# Altium schematic sheet 04_ethernet.SchDoc
size D; CompanyName: Signal Laboratories, Inc.; Address1: 3479 Edison Way; Address2: Menlo Park CA 94025; Address3: +1 (877) 778-8435; Address4: siglabs.com; Revision: 1; SheetNumber: 1; SheetTotal: 1
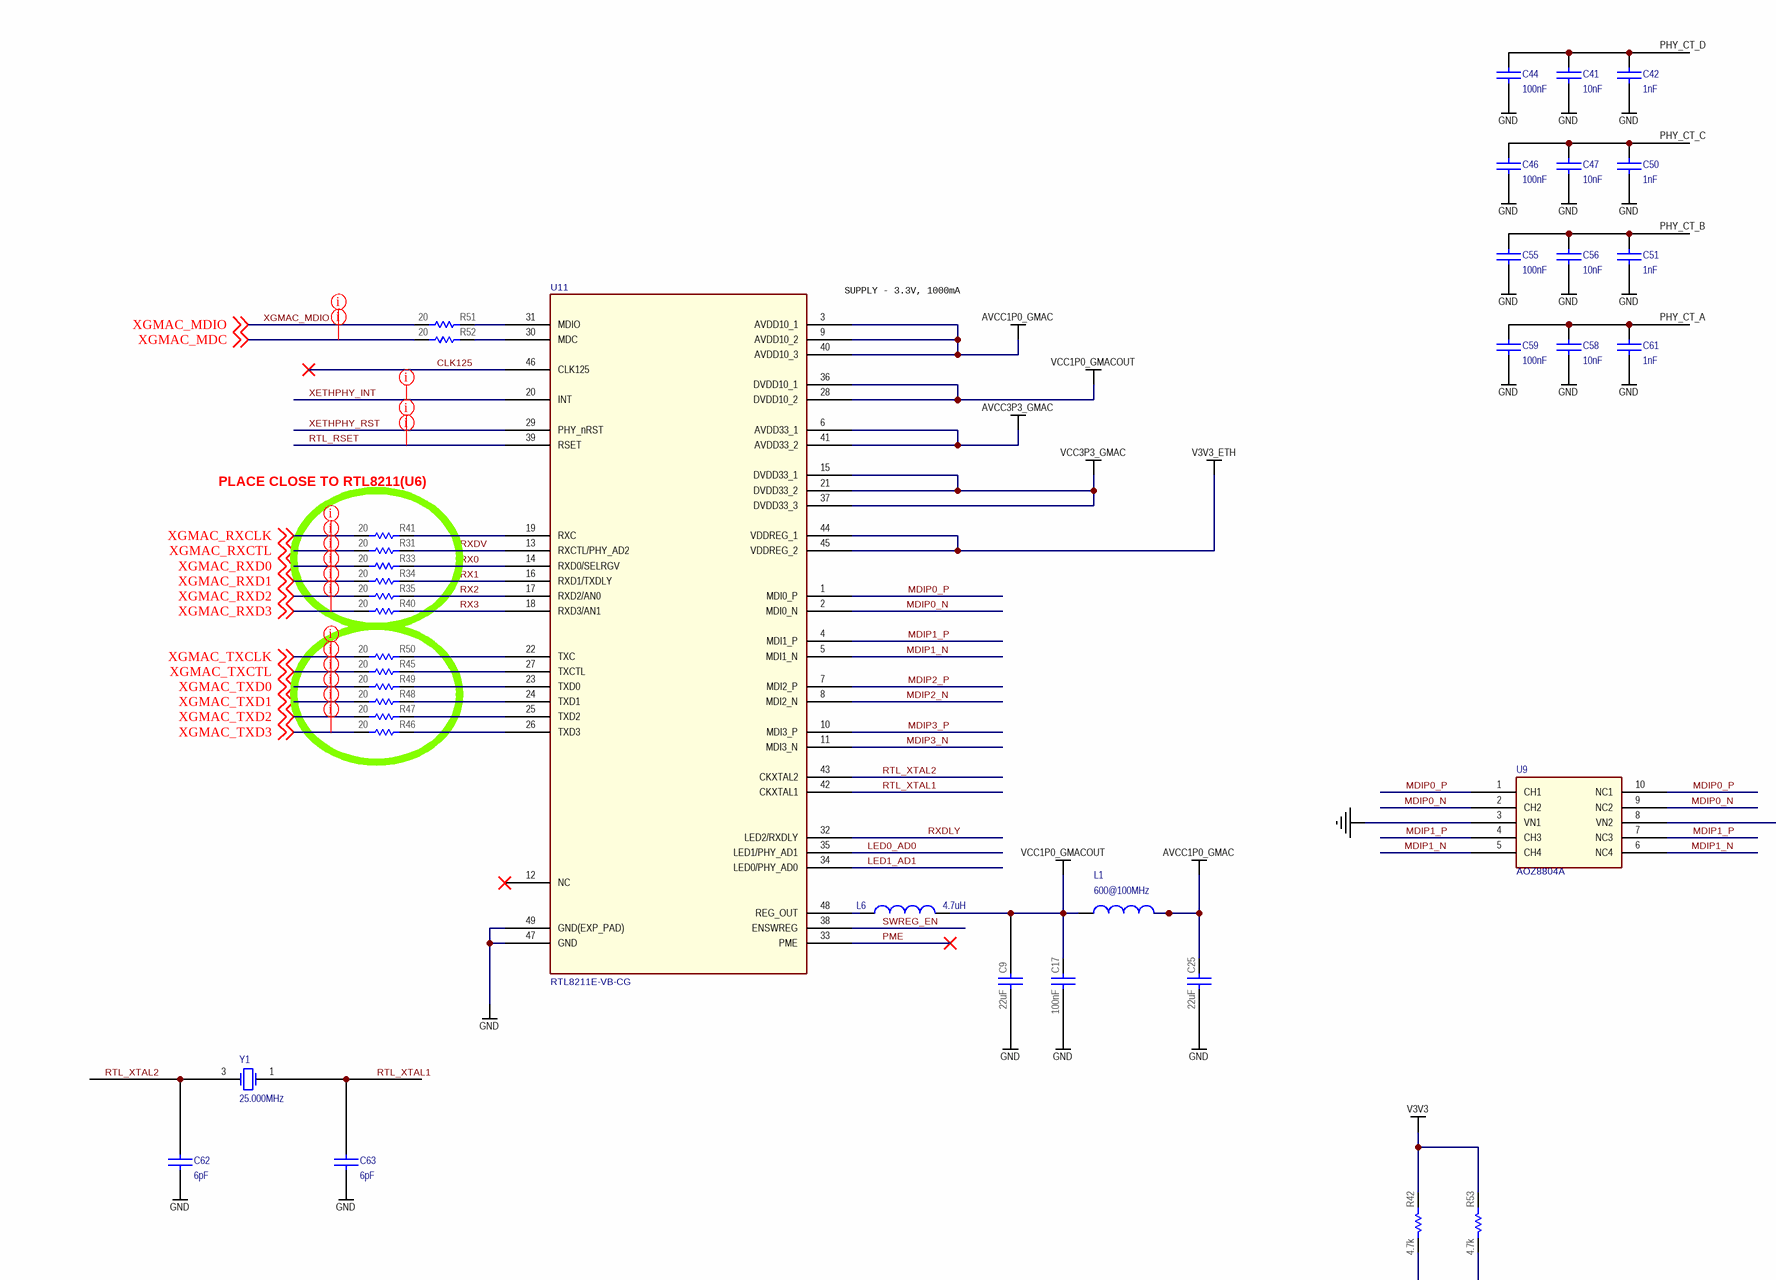
[diagram p0: 04_ethernet.SchDoc, top left]
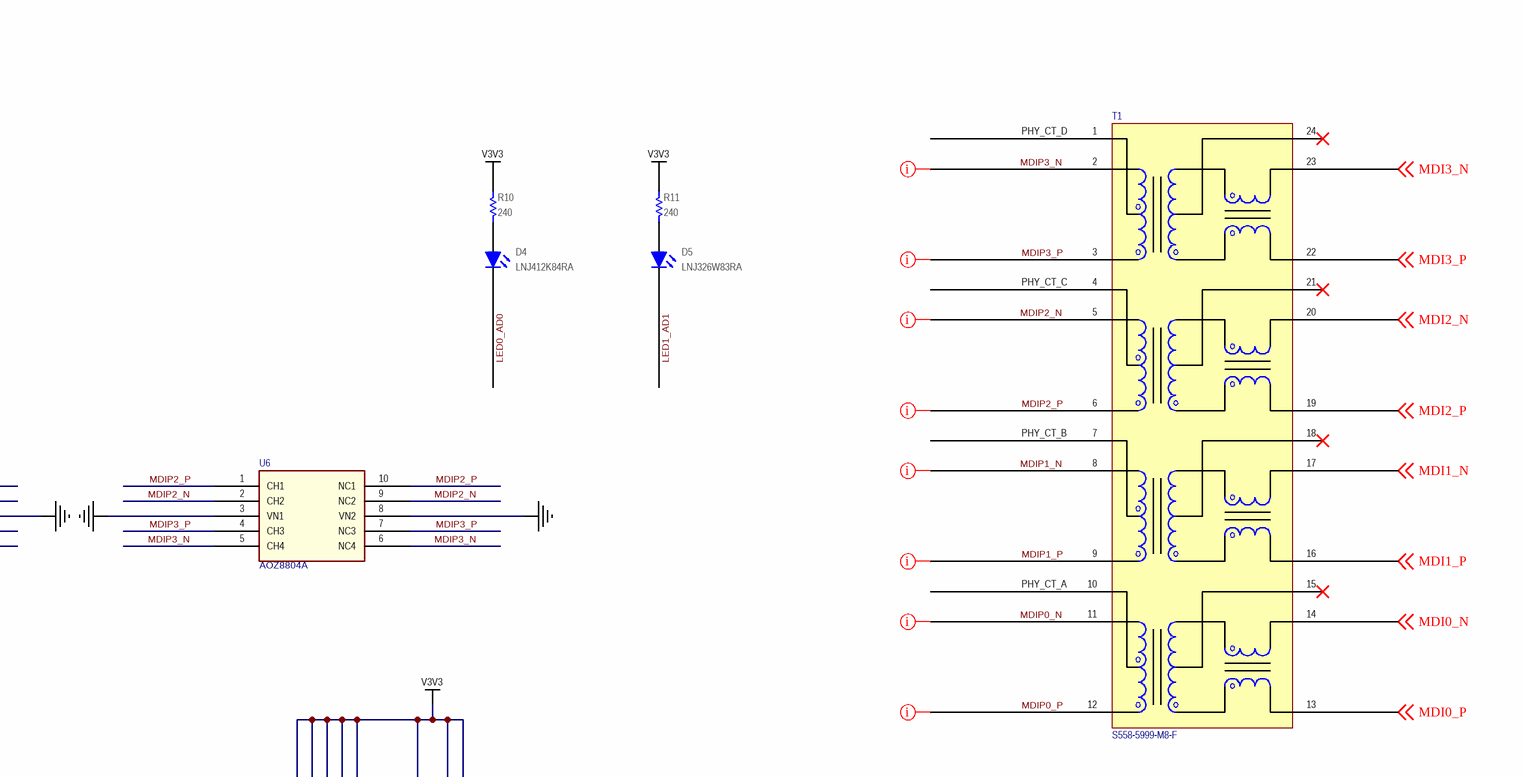
[diagram p1: 04_ethernet.SchDoc, top right]
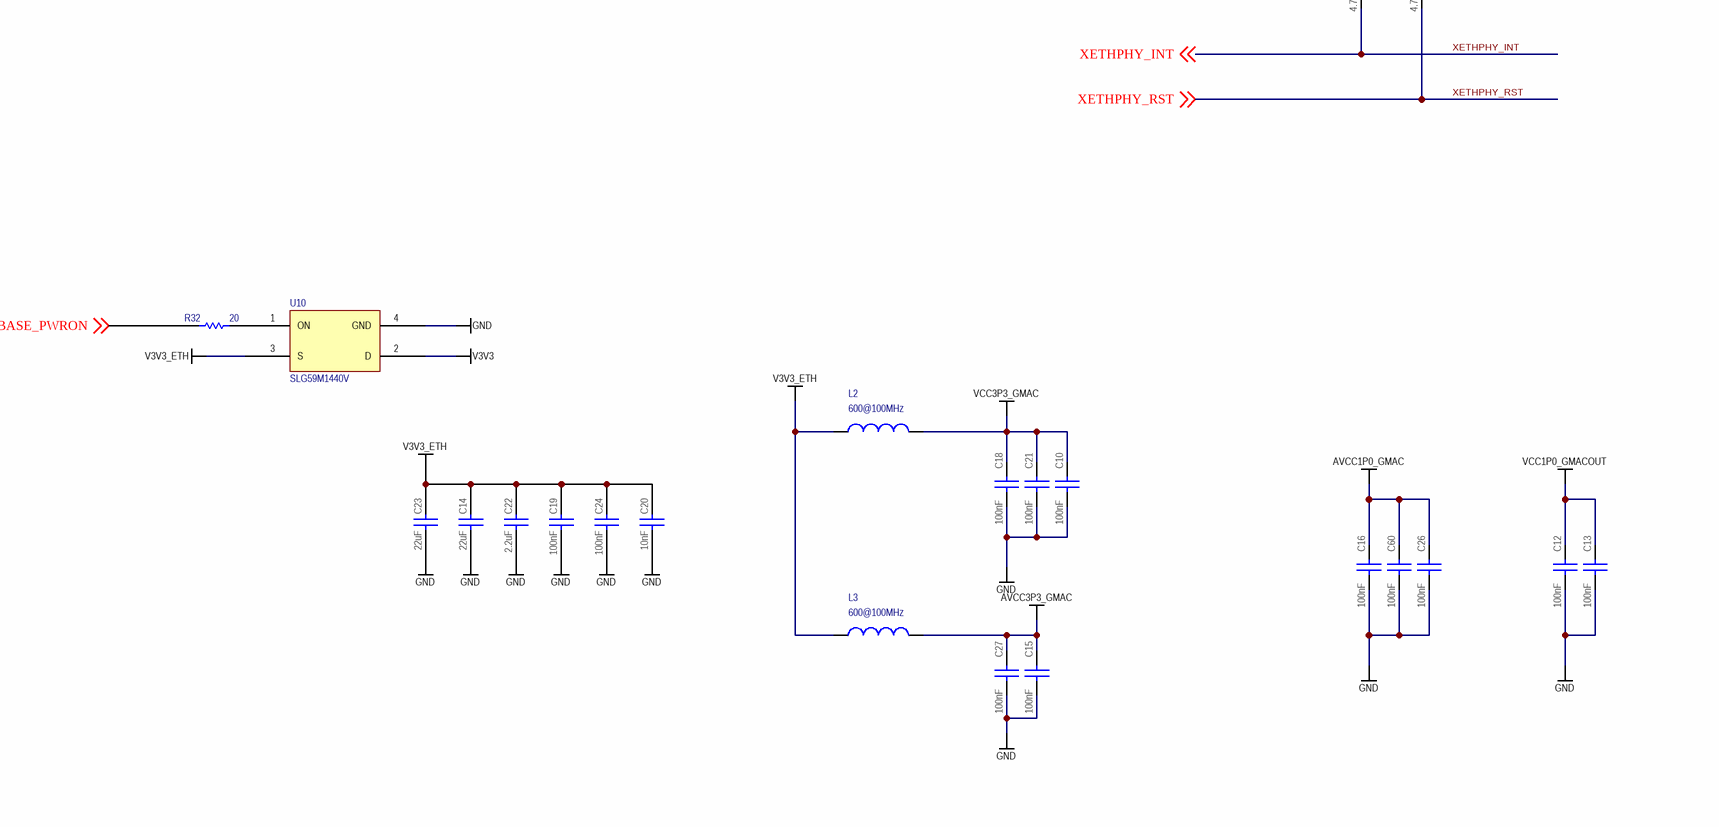
[diagram p2: 04_ethernet.SchDoc, bottom left]
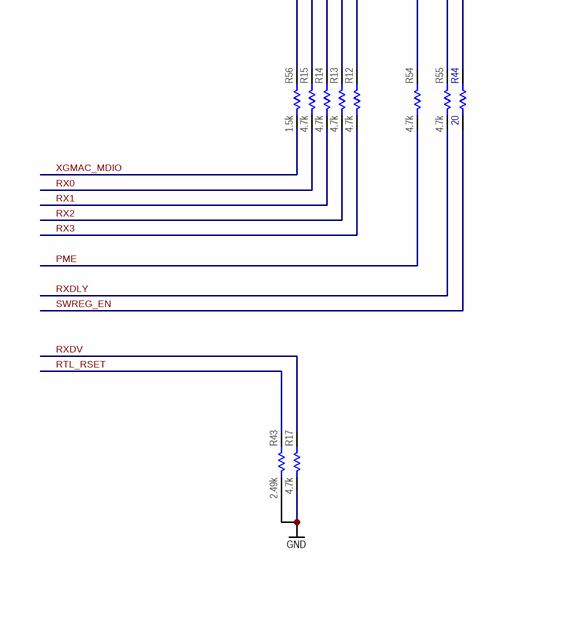
[diagram p3: 04_ethernet.SchDoc, bottom right]

## Parts
C9  value 22uF  [CAPC200X125X145L45N]  (hidden comment: C2012X7S1A226M125)
C10  value 100nF  [CAPC100X50X55L25N]  (hidden comment: GCM155R71H104KE02)
C12  value 100nF  [CAPC100X50X55L25N]  (hidden comment: GCM155R71H104KE02)
C13  value 100nF  [CAPC100X50X55L25N]  (hidden comment: GCM155R71H104KE02)
C14  value 22uF  [CAPC200X125X145L45N]  (hidden comment: C2012X7S1A226M125)
C15  value 100nF  [CAPC100X50X55L25N]  (hidden comment: GCM155R71H104KE02)
C16  value 100nF  [CAPC100X50X55L25N]  (hidden comment: GCM155R71H104KE02)
C17  value 100nF  [CAPC100X50X55L25N]  (hidden comment: GCM155R71H104KE02)
C18  value 100nF  [CAPC100X50X55L25N]  (hidden comment: GCM155R71H104KE02)
C19  value 100nF  [CAPC100X50X55L25N]  (hidden comment: GCM155R71H104KE02)
C20  value 10nF  [CAPC100X50X55L25N]  (hidden comment: GRM155R71H103KA88)
C21  value 100nF  [CAPC100X50X55L25N]  (hidden comment: GCM155R71H104KE02)
C22  value 2.2uF  [CAPC160X80X90L20N]  (hidden comment: C1608X7R1A225M080)
C23  value 22uF  [CAPC200X125X145L45N]  (hidden comment: C2012X7S1A226M125)
C24  value 100nF  [CAPC100X50X55L25N]  (hidden comment: GCM155R71H104KE02)
C25  value 22uF  [CAPC200X125X145L45N]  (hidden comment: C2012X7S1A226M125)
C26  value 100nF  [CAPC100X50X55L25N]  (hidden comment: GCM155R71H104KE02)
C27  value 100nF  [CAPC100X50X55L25N]  (hidden comment: GCM155R71H104KE02)
C41  value 10nF  [0402]  (hidden comment: GRM155R71E103KA01D)
C42  value 1nF  [0402]  (hidden comment: GRM1555C1H102JA01D)
C44  value 100nF  [0402]  (hidden comment: GRM155R71C104KA88J)
C46  value 100nF  [0402]  (hidden comment: GRM155R71C104KA88J)
C47  value 10nF  [0402]  (hidden comment: GRM155R71E103KA01D)
C50  value 1nF  [0402]  (hidden comment: GRM1555C1H102JA01D)
C51  value 1nF  [0402]  (hidden comment: GRM1555C1H102JA01D)
C55  value 100nF  [0402]  (hidden comment: GRM155R71C104KA88J)
C56  value 10nF  [0402]  (hidden comment: GRM155R71E103KA01D)
C58  value 10nF  [0402]  (hidden comment: GRM155R71E103KA01D)
C59  value 100nF  [0402]  (hidden comment: GRM155R71C104KA88J)
C60  value 100nF  [CAPC100X50X55L25N]  (hidden comment: GCM155R71H104KE02)
C61  value 1nF  [0402]  (hidden comment: GRM1555C1H102JA01D)
C62  value 6pF  [0402]  (hidden comment: GJM1555C1H6R0CB01D)
C63  value 6pF  [0402]  (hidden comment: GJM1555C1H6R0CB01D)
D4  LNJ412K84RA  [0603_LED]
D5  LNJ326W83RA  [0603_LED]
L1  value 600@100MHz  [INDC1005X55N]  (hidden comment: BLM15PX601SN1D)
L2  value 600@100MHz  [INDC1005X55N]  (hidden comment: BLM15PX601SN1D)
L3  value 600@100MHz  [INDC1005X55N]  (hidden comment: BLM15PX601SN1D)
L6  value 4.7uH  [INDC200X125X105L50N]  (hidden comment: CIG21L4R7MNE)
R10  value 240  [RESC1005X40N]  (hidden comment: ERJ-2RKF2400X)
R11  value 240  [RESC1005X40N]  (hidden comment: ERJ-2RKF2400X)
R12  value 4.7k  [RESC1005X40N]  (hidden comment: ERJ-2RKF4701X)
R13  value 4.7k  [RESC1005X40N]  (hidden comment: ERJ-2RKF4701X)
R14  value 4.7k  [RESC1005X40N]  (hidden comment: ERJ-2RKF4701X)
R15  value 4.7k  [RESC1005X40N]  (hidden comment: ERJ-2RKF4701X)
R17  value 4.7k  [RESC1005X40N]  (hidden comment: ERJ-2RKF4701X)
R31  value 20  [RESC1005X40N]  (hidden comment: ERJ-2RKF20R0X)
R32  value 20  [0402]  (hidden comment: ERJ-2RKF20R0X)
R33  value 20  [RESC1005X40N]  (hidden comment: ERJ-2RKF20R0X)
R34  value 20  [RESC1005X40N]  (hidden comment: ERJ-2RKF20R0X)
R35  value 20  [RESC1005X40N]  (hidden comment: ERJ-2RKF20R0X)
R40  value 20  [RESC1005X40N]  (hidden comment: ERJ-2RKF20R0X)
R41  value 20  [RESC1005X40N]  (hidden comment: ERJ-2RKF20R0X)
R42  value 4.7k  [RESC1005X40N]  (hidden comment: ERJ-2RKF4701X)
R43  value 2.49k  [RESC1005X40N]  (hidden comment: ERJ-2RKF2491X)
R44  value 20  [0402]  (hidden comment: ERJ-2RKF20R0X)
R45  value 20  [RESC1005X40N]  (hidden comment: ERJ-2RKF20R0X)
R46  value 20  [RESC1005X40N]  (hidden comment: ERJ-2RKF20R0X)
R47  value 20  [RESC1005X40N]  (hidden comment: ERJ-2RKF20R0X)
R48  value 20  [RESC1005X40N]  (hidden comment: ERJ-2RKF20R0X)
R49  value 20  [RESC1005X40N]  (hidden comment: ERJ-2RKF20R0X)
R50  value 20  [RESC1005X40N]  (hidden comment: ERJ-2RKF20R0X)
R51  value 20  [RESC1005X40N]  (hidden comment: ERJ-2RKF20R0X)
R52  value 20  [RESC1005X40N]  (hidden comment: ERJ-2RKF20R0X)
R53  value 4.7k  [RESC1005X40N]  (hidden comment: ERJ-2RKF4701X)
R54  value 4.7k  [RESC1005X40N]  (hidden comment: ERJ-2RKF4701X)
R55  value 4.7k  [RESC1005X40N]  (hidden comment: ERJ-2RKF4701X)
R56  value 1.5k  [RESC1005X40N]  (hidden comment: ERJ-2RKF1501X)
T1  S558-5999-M8-F  [SOIC127P1524X571-24N]
U6  AOZ8804A  [AOZ8804]
U9  AOZ8804A  [AOZ8804]
U10  SLG59M1440V  [SLG59M1440V]
U11  RTL8211E-VB-CG  [QFN48]
Y1  Freq: 25.000MHz  [XRCGB]  (hidden comment: XRCGB25M000F3N00R0)

## Nets
AVCC1P0_GMAC: C16.2 C25.2 C26.2 C60.2 L1.2 U11.3(AVDD10_1) U11.9(AVDD10_2) U11.40(AVDD10_3)
AVCC3P3_GMAC: C15.2 C27.2 L3.2 U11.6(AVDD33_1) U11.41(AVDD33_2)
GND: C9.1 C10.1 C12.1 C13.1 C14.1 C15.1 C16.1 C17.1 C18.1 C19.1 C20.2 C21.1 C22.1 C23.1 C24.1 C25.1 C26.1 C27.1 C41.1 C42.1 C44.1 C46.1 C47.1 C50.1 C51.1 C55.1 C56.1 C58.1 C59.1 C60.1 C61.1 C62.1 C63.1 R17.1 R43.2 U6.3(VN1) U6.8(VN2) U9.3(VN1) U9.8(VN2) U10.4(GND) U11.47(GND) U11.49(GND(EXP_PAD))
V3V3: R10.1 R11.1 R12.2 R13.2 R14.2 R15.2 R42.2 R44.1 R53.2 R54.2 R55.2 R56.1 U10.2(D)
V3V3_ETH: C14.2 C19.2 C20.1 C22.2 C23.2 C24.2 L2.1 L3.1 U10.3(S) U11.44(VDDREG_1) U11.45(VDDREG_2)
VCC1P0_GMACOUT: C9.2 C12.2 C13.2 C17.2 L1.1 L6.2 U11.28(DVDD10_2) U11.36(DVDD10_1)
VCC3P3_GMAC: C10.2 C18.2 C21.2 L2.2 U11.15(DVDD33_1) U11.21(DVDD33_2) U11.37(DVDD33_3)
CLK125: U11.46(CLK125)
LED0_AD0: D4.2(K) U11.35(LED1/PHY_AD1)
LED1_AD1: D5.2(K) U11.34(LED0/PHY_AD0)
MDI0_N: T1.14(TXONA) ; off-sheet MDI0_N
MDI0_P: T1.13(TXOPA) ; off-sheet MDI0_P
MDI1_N: T1.17(TXONB) ; off-sheet MDI1_N
MDI1_P: T1.16(TXOPB) ; off-sheet MDI1_P
MDI2_N: T1.20(TXONC) ; off-sheet MDI2_N
MDI2_P: T1.19(TXOPC) ; off-sheet MDI2_P
MDI3_N: T1.23(TXOND) ; off-sheet MDI3_N
MDI3_P: T1.22(TXOPD) ; off-sheet MDI3_P
MDIP0_N: T1.11(TPONA) U9.2(CH2) U9.9(NC2) U11.2(MDI0_N)
MDIP0_P: T1.12(TPOPA) U9.1(CH1) U9.10(NC1) U11.1(MDI0_P)
MDIP1_N: T1.8(TPONB) U9.5(CH4) U9.6(NC4) U11.5(MDI1_N)
MDIP1_P: T1.9(TPOPB) U9.4(CH3) U9.7(NC3) U11.4(MDI1_P)
MDIP2_N: T1.5(TPONC) U6.2(CH2) U6.9(NC2) U11.8(MDI2_N)
MDIP2_P: T1.6(TPOPC) U6.1(CH1) U6.10(NC1) U11.7(MDI2_P)
MDIP3_N: T1.2(TPOND) U6.5(CH4) U6.6(NC4) U11.11(MDI3_N)
MDIP3_P: T1.3(TPOPD) U6.4(CH3) U6.7(NC3) U11.10(MDI3_P)
PHY_CT_A: C58.2 C59.2 C61.2 T1.10(TCTA)
PHY_CT_B: C51.2 C55.2 C56.2 T1.7(TCTB)
PHY_CT_C: C46.2 C47.2 C50.2 T1.4(TCTC)
PHY_CT_D: C41.2 C42.2 C44.2 T1.1(TCTD)
PME: R54.1 U11.33(PME)
RTL_RSET: R43.1 U11.39(RSET)
RTL_XTAL1: C63.2 U11.42(CKXTAL1) Y1.1(OSC1)
RTL_XTAL2: C62.2 U11.43(CKXTAL2) Y1.3(OSC2)
RX0: R15.1 R33.2 U11.14(RXD0/SELRGV)
RX1: R14.1 R34.2 U11.16(RXD1/TXDLY)
RX2: R13.1 R35.2 U11.17(RXD2/AN0)
RX3: R12.1 R40.2 U11.18(RXD3/AN1)
RXDLY: R55.1 U11.32(LED2/RXDLY)
RXDV: R17.2 R31.2 U11.13(RXCTL/PHY_AD2)
SWREG_EN: R44.2 U11.38(ENSWREG)
XBASE_PWRON: R32.2 ; off-sheet XBASE_PWRON
XETHPHY_INT: R42.1 U11.20(INT) ; off-sheet XETHPHY_INT
XETHPHY_RST: R53.1 U11.29(PHY_nRST) ; off-sheet XETHPHY_RST
XGMAC_MDC: R52.1 ; off-sheet XGMAC_MDC
XGMAC_MDIO: R51.1 R56.2 ; off-sheet XGMAC_MDIO
XGMAC_RXCLK: R41.1 ; off-sheet XGMAC_RXCLK
XGMAC_RXCTL: R31.1 ; off-sheet XGMAC_RXCTL
XGMAC_RXD0: R33.1 ; off-sheet XGMAC_RXD0
XGMAC_RXD1: R34.1 ; off-sheet XGMAC_RXD1
XGMAC_RXD2: R35.1 ; off-sheet XGMAC_RXD2
XGMAC_RXD3: R40.1 ; off-sheet XGMAC_RXD3
XGMAC_TXCLK: R50.1 ; off-sheet XGMAC_TXCLK
XGMAC_TXCTL: R45.1 ; off-sheet XGMAC_TXCTL
XGMAC_TXD0: R49.1 ; off-sheet XGMAC_TXD0
XGMAC_TXD1: R48.1 ; off-sheet XGMAC_TXD1
XGMAC_TXD2: R47.1 ; off-sheet XGMAC_TXD2
XGMAC_TXD3: R46.1 ; off-sheet XGMAC_TXD3
NetD4_1: D4.1(A) R10.2
NetD5_1: D5.1(A) R11.2
NetL6_1: L6.1 U11.48(REG_OUT)
NetR32_1: R32.1 U10.1(ON)
NetR41_2: R41.2 U11.19(RXC)
NetR45_2: R45.2 U11.27(TXCTL)
NetR46_2: R46.2 U11.26(TXD3)
NetR47_2: R47.2 U11.25(TXD2)
NetR48_2: R48.2 U11.24(TXD1)
NetR49_2: R49.2 U11.23(TXD0)
NetR50_2: R50.2 U11.22(TXC)
NetR51_2: R51.2 U11.31(MDIO)
NetR52_2: R52.2 U11.30(MDC)

Not connected (* = marked no-connect by the designer): T1 15(TXTA)* 18(TXTB)* 21(TXTC)* 24(TXTD)*; U11 12(NC)*; Y1 2(NC) 4(NC)

## Layout directives
net class ETH: MDIP0_N, MDIP0_P, MDIP1_N, MDIP1_P, MDIP2_N, MDIP2_P, MDIP3_N, MDIP3_P
net class MAC: RTL_RSET, XETHPHY_INT, XETHPHY_RST, XGMAC_MDC, XGMAC_MDIO, XGMAC_RXCLK, XGMAC_RXCTL, XGMAC_RXD0, XGMAC_RXD1, XGMAC_RXD2, XGMAC_RXD3, XGMAC_TXCLK, XGMAC_TXCTL, XGMAC_TXD0, XGMAC_TXD1, XGMAC_TXD2, XGMAC_TXD3

## Notes on the sheet
- (near U11) SUPPLY - 3.3V, 1000mA
- PLACE CLOSE TO RTL8211(U6)
- Title
- Engineer
- Revision
- Drawn By
- Sheet
- of
- Checked By
- Date

## Library data of the parts
C9 C14 C23 C25 = CAP: Ceramic Capacitor 22uF ±20% 10V X7S 0805; Manufacturer: TDK; Tr: -55:125; Manufacturer P/N: C2012X7S1A226M125; Tolerance: ±20%; Voltage: 10V; Package: 0805
C10 C12 C13 C15-C19 C21 C24 C26 C27 C60 = CAP: Ceramic Capacitor 100nF ±10% 50V X7R 0402; Manufacturer: Murata; Tr: -55:125; Manufacturer P/N: GCM155R71H104KE02; Tolerance: ±10%; Voltage: 50V; Footprint: *; Package: 0402
C20 = CAP: Ceramic Capacitor 10nF ±10% 50V X7R 0402; Manufacturer: Murata; Tr: -55:125; Manufacturer P/N: GRM155R71H103KA88; Tolerance: ±10%; Voltage: 50V; Package: 0402
C22 = CAP: Ceramic Capacitor 2.2uF ±20% 10V X7R 0603; Manufacturer: TDK; Tr: -55:125; Manufacturer P/N: C1608X7R1A225M080; Tolerance: ±20%; Voltage: 10V; Footprint: *; Package: 0603
C41 C47 C56 C58 = CAP 0402: Ceramic Capacitor 10nF ±10% 25V X7R 0402; Manufacturer: Murata; Tr: -55:125; Voltage: 25V; Manufacturer P/N: GRM155R71E103KA01D; Package: 0402; Tolerance: ±10%
C42 C50 C51 C61 = CAP 0402: Ceramic Capacitor 1nF ±5% 50V NP0 0402; Manufacturer: Murata; Tr: -55:125; Voltage: 50V; Manufacturer P/N: GRM1555C1H102JA01D; Package: 0402; Tolerance: ±5%
C44 C46 C55 C59 = CAP 0402: Ceramic Capacitor 100nF ±10% 16V X7R 0402; Manufacturer: Murata; Tr: -55:125; Voltage: 16V; Manufacturer P/N: GRM155R71C104KA88J; Package: 0402; Tolerance: ±10%
C62 C63 = CAP 0402: Ceramic Capacitor 6pF ±0.25pF 50V NP0 RF 0402; Manufacturer: Murata; Tr: -55:125; Voltage: 50V; Manufacturer P/N: GJM1555C1H6R0CB01D; Package: 0402; Tolerance: ±0.25pF
D4 = LED0603Y: LED, SMT 0603, Color Amber, 10mA, 2.05V; Manufacturer: Panasonic; Manufacturer P/N: LNJ412K84RA; Package: 0603 Polarized
D5 = LED0603GR: LED, SMT 0603, Color Green, 10mA, 2.05V; Manufacturer: Panasonic; Manufacturer P/N: LNJ326W83RA; Package: 0603 Polarized
L1-L3 = IND 0402: Ferrite Bead 600-Ohm @ 100MHz 900mA 0402; Manufacturer: Murata; Tolerance: ±25%; Tr: -55:125; Manufacturer P/N: BLM15PX601SN1D; Package: 0402
L6 = INDUCTOR: 4.7uH Inductor 750mA 260mOhm 0805; Manufacturer: Samsung; Manufacturer P/N: CIG21L4R7MNE
R10 R11 = RES: Thick Film Resistor 240 ±1% 0.1W 75V 0402; Manufacturer: Panasonic; Tcr: ±100; Tr: -55:155; Voltage: 75; Power: 0.1; Tolerance: ±1%; Manufacturer P/N: ERJ-2RKF2400X; Alternatives: *; Footprint: *; Package: 0402
R12-R15 R17 R42 R53-R55 = RES: Thick Film Resistor 4.7k ±1% 0.1W 75V 0402; Manufacturer: Panasonic; Tcr: ±100; Tr: -55:155; Voltage: 75; Power: 0.1; Tolerance: ±1%; Manufacturer P/N: ERJ-2RKF4701X; Alternatives: *; Footprint: *; Package: 0402
R31 R33-R35 R40 R41 R45-R52 = RES: Thick Film Resistor 20 ±1% 0.1W 75V 0402; Manufacturer: Panasonic; Tcr: ±100; Tr: -55:155; Voltage: 75; Power: 0.1; Tolerance: ±1%; Manufacturer P/N: ERJ-2RKF20R0X; Alternatives: *; Footprint: *; Package: 0402
R32 R44 = RES 0402: Thick Film Resistor 20 ±1% 0402; Manufacturer: Panasonic; Manufacturer P/N: RC0402FR-0720L; Tr: -55:155; Package: 0402; Tolerance: ±1%
R43 = RES: Thick Film Resistor 2.49k ±1% 0.1W 75V 0402; Manufacturer: Panasonic; Tcr: ±100; Tr: -55:155; Voltage: 75; Power: 0.1; Tolerance: ±1%; Manufacturer P/N: ERJ-2RKF2491X; Alternatives: *; Footprint: *; Package: 0402
R56 = RES: Thick Film Resistor 1.5k ±1% 0.1W 75V 0402; Manufacturer: Panasonic; Tcr: ±100; Tr: -55:155; Voltage: 75; Power: 0.1; Tolerance: ±1%; Manufacturer P/N: ERJ-2RKF1501X; Alternatives: *; Footprint: *; Package: 0402
T1 = S558-5999-M8-F: Gigabit LAN transformer; Manufacturer: Bel Fuse; Manufacturer P/N: S558-5999-M8-F
U6 U9 = ICMEF112P900MFR_5: Ultra-low Capacitance TVS Diodes; Manufacturer: Alpha & Omega; Manufacturer P/N: AOZ8804
U10 = SLG59M1440V: Ultra-small 1.5A High-Side Load Switch; Manufacturer: Silego; Manufacturer P/N: SLG59M1440V
U11 = CON_40P_6.5mm: Gigabit Ethernet Transceiver; Manufacturer: Realtek; Manufacturer P/N: RTL8211E-VB-CG
Y1 = XRCGB25M000F3N00R0: CRYSTAL, 25.000MHz, 30ppm, 6pF; Manufacturer: Murata; Manufacturer P/N: XRCGB25M000F3N00R0; C: 6pF